# EAGLE schematic backplane-5 (EAGLE 8.3.1)

## Sheet 1 of 6
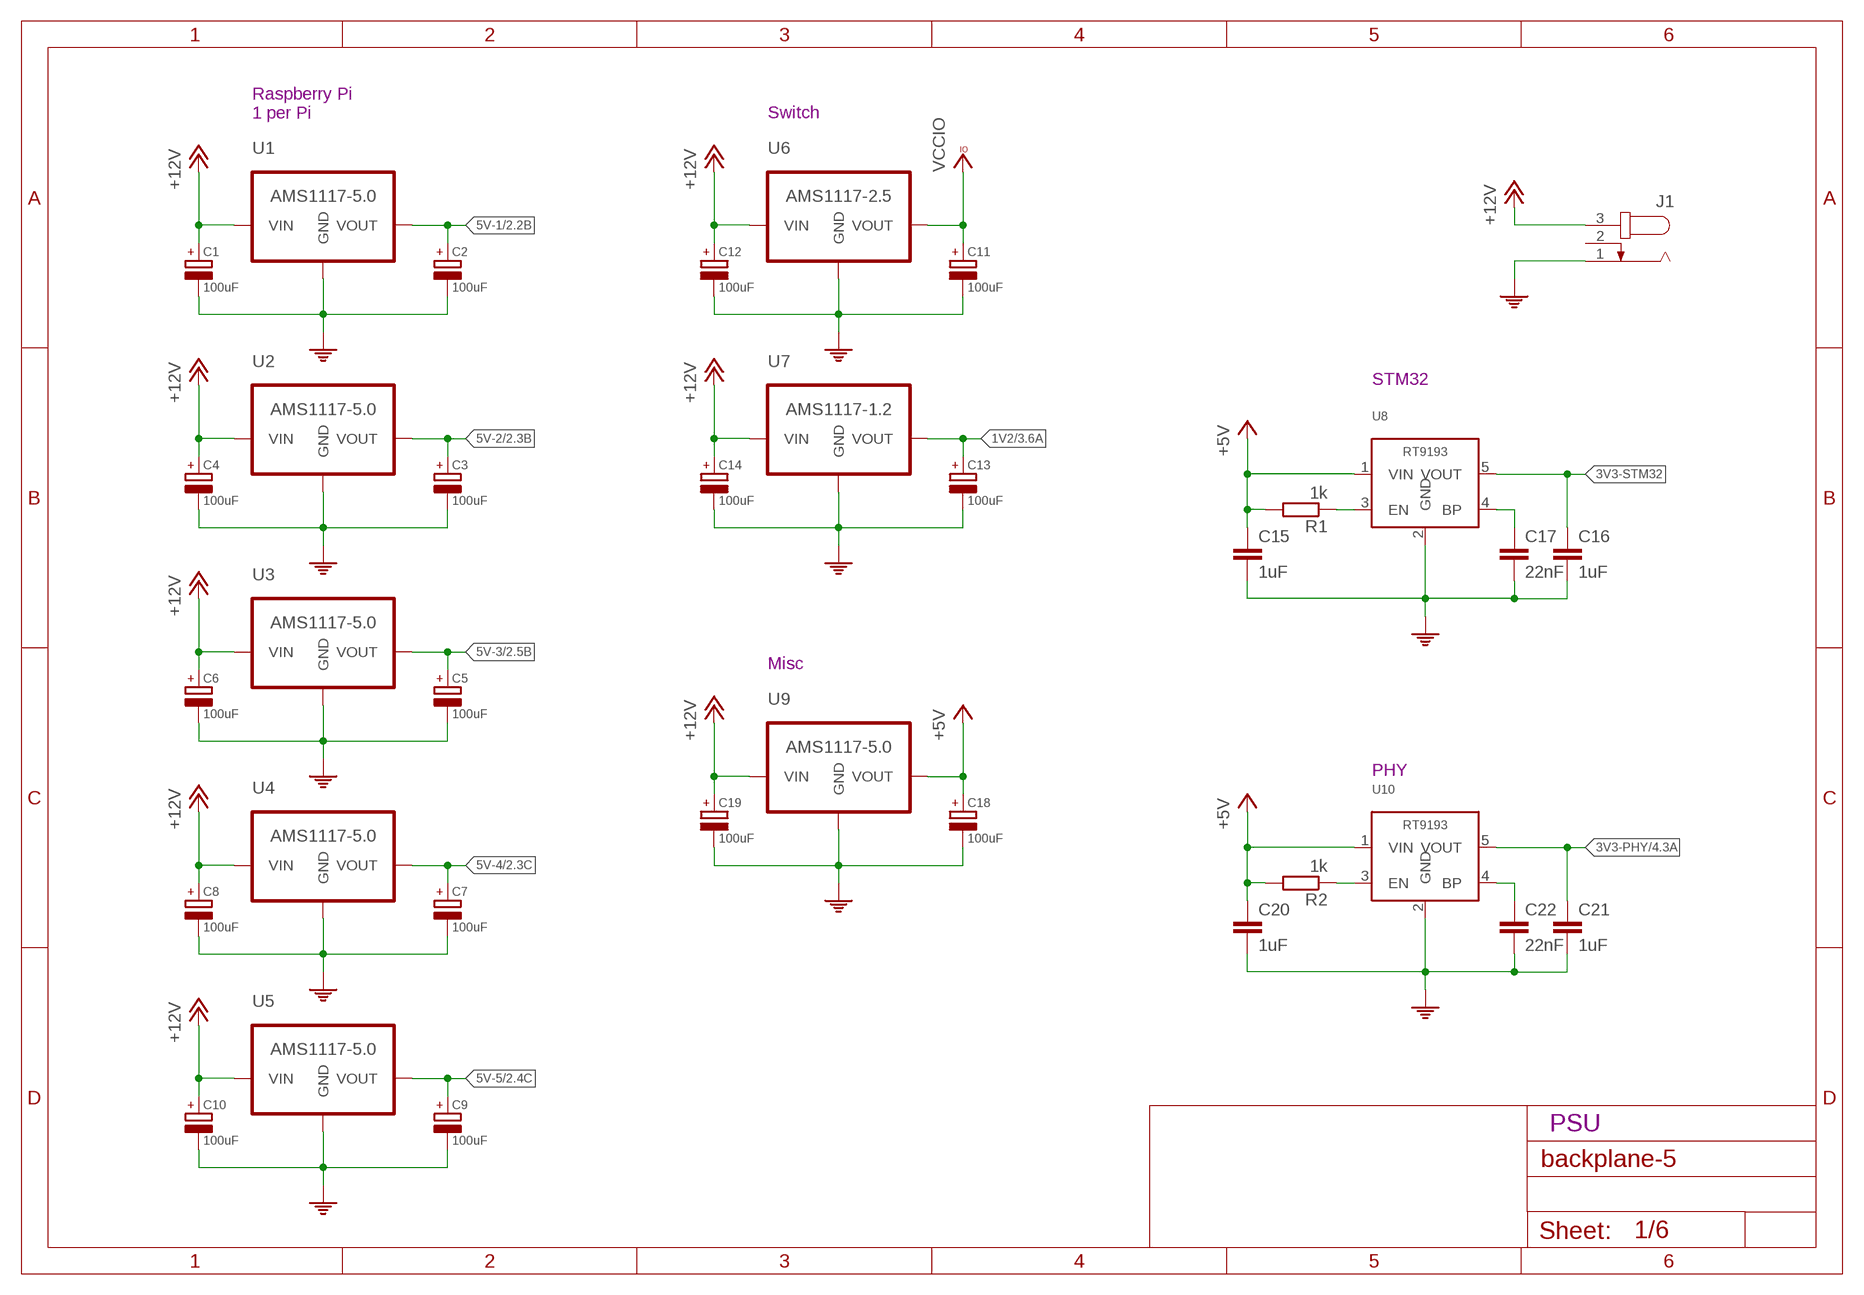
[diagram p0: schematic, sheet 1]

### Parts
C1  100uF  CAPACITOR  [CAP-D6.3]
C2  100uF  CAPACITOR  [CAP-D6.3]
C3  100uF  CAPACITOR  [CAP-D6.3]
C4  100uF  CAPACITOR  [CAP-D6.3]
C5  100uF  CAPACITOR  [CAP-D6.3]
C6  100uF  CAPACITOR  [CAP-D6.3]
C7  100uF  CAPACITOR  [CAP-D6.3]
C8  100uF  CAPACITOR  [CAP-D6.3]
C9  100uF  CAPACITOR  [CAP-D6.3]
C10  100uF  CAPACITOR  [CAP-D6.3]
C11  100uF  CAPACITOR  [CAP-D6.3]
C12  100uF  CAPACITOR  [CAP-D6.3]
C13  100uF  CAPACITOR  [CAP-D6.3]
C14  100uF  CAPACITOR  [CAP-D6.3]
C15  1uF  C-EUC0603  [C0603]
C16  1uF  C-EUC0603  [C0603]
C17  22nF  C-EUC0603  [C0603]
C18  100uF  CAPACITOR  [CAP-D6.3]
C19  100uF  CAPACITOR  [CAP-D6.3]
C20  1uF  C-EUC0603  [C0603]
C21  1uF  C-EUC0603  [C0603]
C22  22nF  C-EUC0603  [C0603]
J1  JACK-PLUG0  [SPC4077]
R1  1k  R-EU_R0603  [R0603]
R2  1k  R-EU_R0603  [R0603]
U1  AMS1117-5.0  LDOAMS1117  [SOT223]
U2  AMS1117-5.0  LDOAMS1117  [SOT223]
U3  AMS1117-5.0  LDOAMS1117  [SOT223]
U4  AMS1117-5.0  LDOAMS1117  [SOT223]
U5  AMS1117-5.0  LDOAMS1117  [SOT223]
U6  AMS1117-2.5  LDOAMS1117  [SOT223]
U7  AMS1117-1.2  LDOAMS1117  [SOT223]
U8  RT9193  [SOT23-5]
U9  AMS1117-5.0  LDOAMS1117  [SOT223]
U10  RT9193  [SOT23-5]

### Nets
1V2: C13.P(POS) U7.2(VOUT) ; also sheet 3,4
3V3-PHY: C21.1 U10.5(VOUT) ; also sheet 4,5
3V3-STM32: C16.1 U8.5(VOUT)
5V-1: C2.P(POS) U1.2(VOUT) ; also sheet 2
5V-2: C3.P(POS) U2.2(VOUT) ; also sheet 2
5V-3: C5.P(POS) U3.2(VOUT) ; also sheet 2
5V-4: C7.P(POS) U4.2(VOUT) ; also sheet 2
5V-5: C9.P(POS) U5.2(VOUT) ; also sheet 2
+5V: C15.1 C18.P(POS) C20.1 R1.2 R2.2 U8.1(VIN) U9.2(VOUT) U10.1(VIN)
+12V: C1.P(POS) C4.P(POS) C6.P(POS) C8.P(POS) C10.P(POS) C12.P(POS) C14.P(POS) C19.P(POS) J1.3 U1.3(VIN) U2.3(VIN) U3.3(VIN) U4.3(VIN) U5.3(VIN) U6.3(VIN) U7.3(VIN) U9.3(VIN)
GND: C1.N(NEG) C2.N(NEG) C3.N(NEG) C4.N(NEG) C5.N(NEG) C6.N(NEG) C7.N(NEG) C8.N(NEG) C9.N(NEG) C10.N(NEG) C11.N(NEG) C12.N(NEG) C13.N(NEG) C14.N(NEG) C15.2 C16.2 C17.2 C18.N(NEG) C19.N(NEG) C20.2 C21.2 C22.2 J1.1 U1.1(GND) U2.1(GND) U3.1(GND) U4.1(GND) U5.1(GND) U6.1(GND) U7.1(GND) U8.2(GND) U9.1(GND) U10.2(GND) ; supply symbol labelled gnd, PE ; also sheet 2,3,4,5,6
N$1: C17.1 U8.4(BP)
N$2: R1.1 U8.3(EN)
N$3: C22.1 U10.4(BP)
N$4: R2.1 U10.3(EN)
VCCIO: C11.P(POS) U6.2(VOUT) ; also sheet 3,4,5,6
Unconnected: J1.2

### Notes on the sheet
- Raspberry Pi
  1 per Pi
- Switch
- STM32
- Misc
- PHY
- PSU

## Sheet 2 of 6
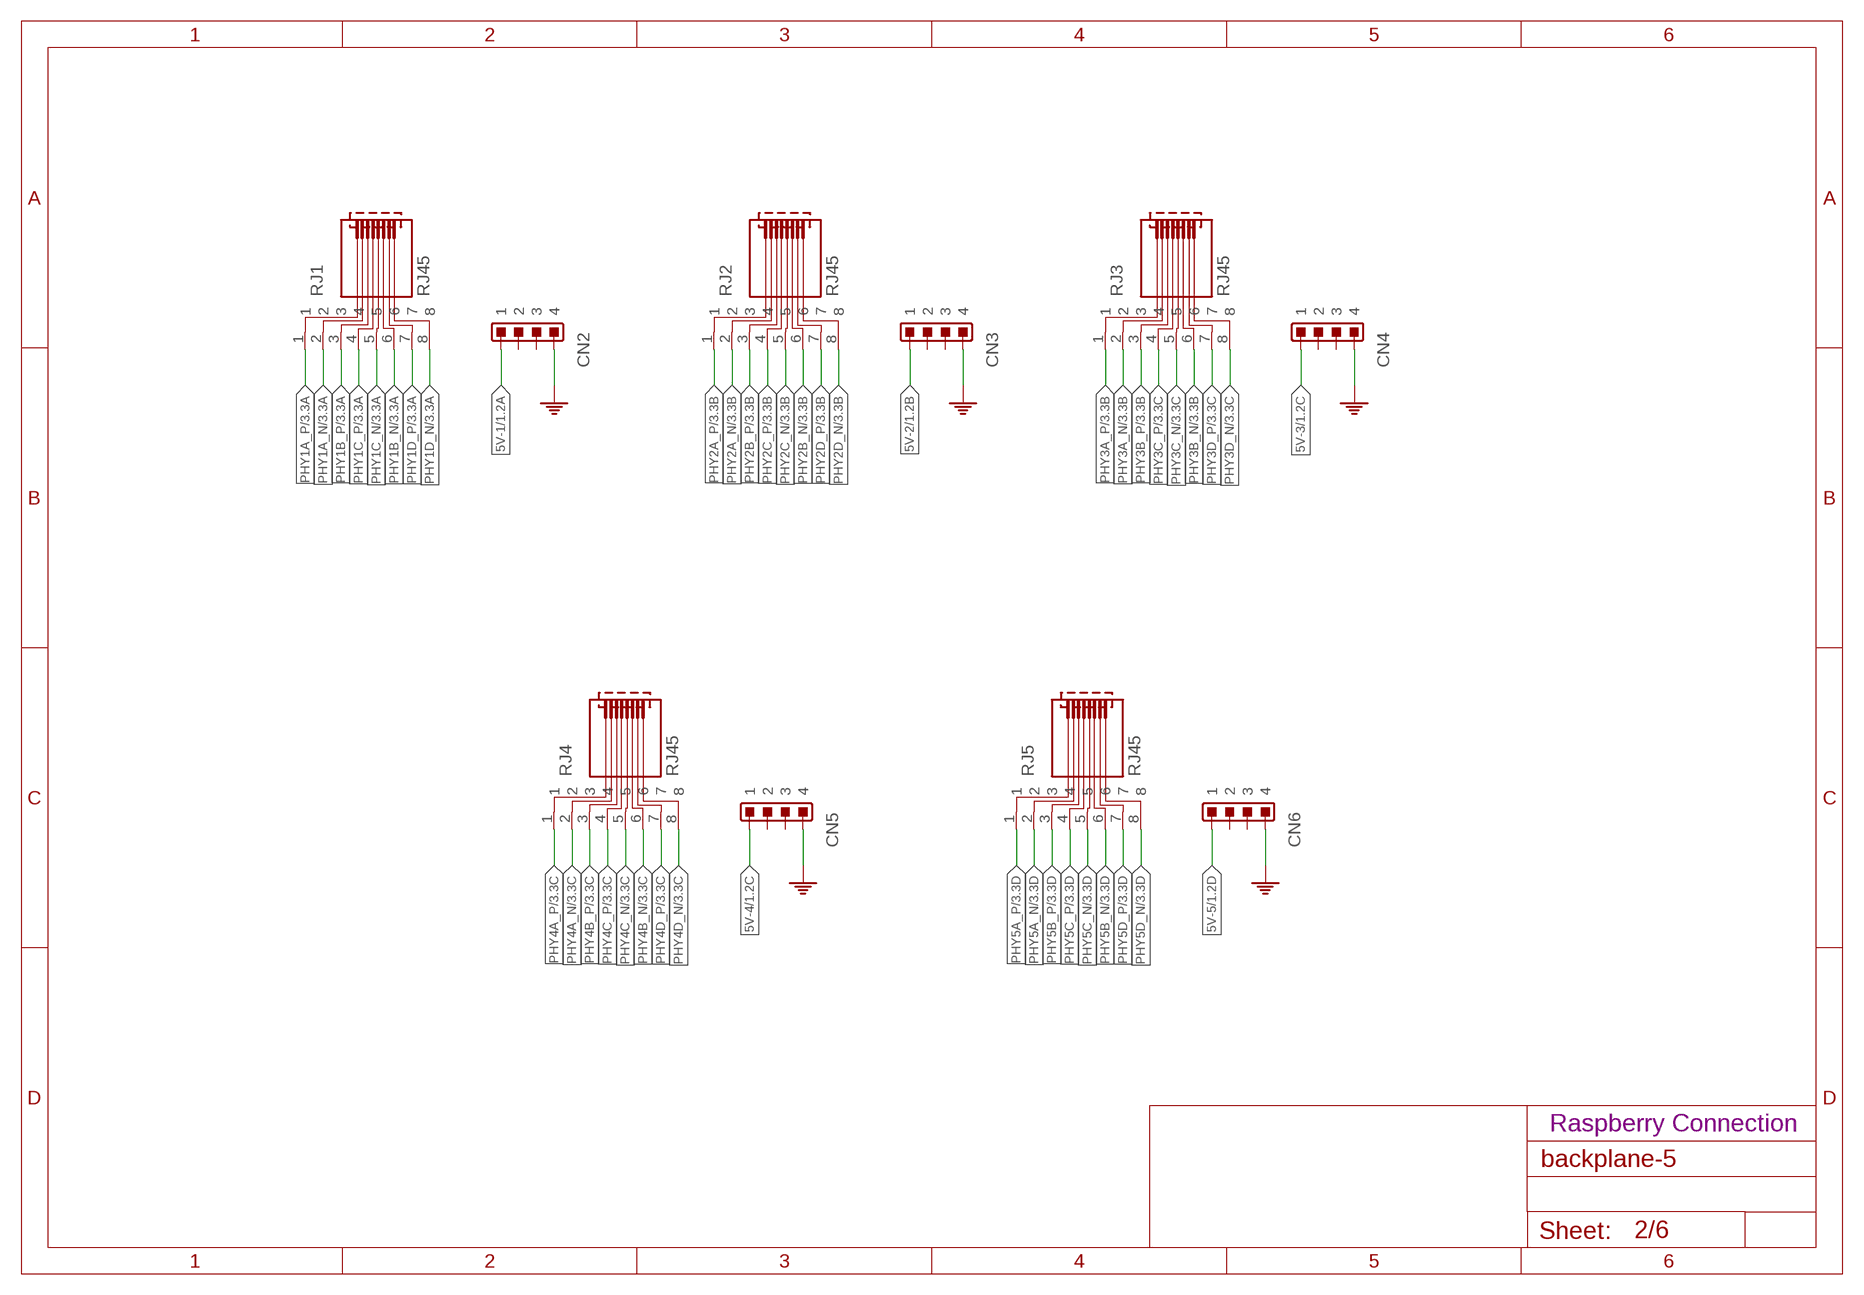
[diagram p1: schematic, sheet 2]

### Parts
CN2  4PINCONNFEMALE-1.6  [4PINCONN-FEMALE-1.6]
CN3  4PINCONNFEMALE-1.6  [4PINCONN-FEMALE-1.6]
CN4  4PINCONNFEMALE-1.6  [4PINCONN-FEMALE-1.6]
CN5  4PINCONNFEMALE-1.6  [4PINCONN-FEMALE-1.6]
CN6  4PINCONNFEMALE-1.6  [4PINCONN-FEMALE-1.6]
RJ1  RJ45PLUG  [RJ45MALE]
RJ2  RJ45PLUG  [RJ45MALE]
RJ3  RJ45PLUG  [RJ45MALE]
RJ4  RJ45PLUG  [RJ45MALE]
RJ5  RJ45PLUG  [RJ45MALE]

### Nets
5V-1: CN2.1@1 CN2.1@2 ; also sheet 1
5V-2: CN3.1@1 CN3.1@2 ; also sheet 1
5V-3: CN4.1@1 CN4.1@2 ; also sheet 1
5V-4: CN5.1@1 CN5.1@2 ; also sheet 1
5V-5: CN6.1@1 CN6.1@2 ; also sheet 1
GND: CN2.4@1 CN2.4@2 CN3.4@1 CN3.4@2 CN4.4@1 CN4.4@2 CN5.4@1 CN5.4@2 CN6.4@1 CN6.4@2 ; supply symbol labelled gnd ; also sheet 1,3,4,5,6
PHY1A_N: RJ1.2 ; also sheet 3
PHY1A_P: RJ1.1 ; also sheet 3
PHY1B_N: RJ1.6 ; also sheet 3
PHY1B_P: RJ1.3 ; also sheet 3
PHY1C_N: RJ1.5 ; also sheet 3
PHY1C_P: RJ1.4 ; also sheet 3
PHY1D_N: RJ1.8 ; also sheet 3
PHY1D_P: RJ1.7 ; also sheet 3
PHY2A_N: RJ2.2 ; also sheet 3
PHY2A_P: RJ2.1 ; also sheet 3
PHY2B_N: RJ2.6 ; also sheet 3
PHY2B_P: RJ2.3 ; also sheet 3
PHY2C_N: RJ2.5 ; also sheet 3
PHY2C_P: RJ2.4 ; also sheet 3
PHY2D_N: RJ2.8 ; also sheet 3
PHY2D_P: RJ2.7 ; also sheet 3
PHY3A_N: RJ3.2 ; also sheet 3
PHY3A_P: RJ3.1 ; also sheet 3
PHY3B_N: RJ3.6 ; also sheet 3
PHY3B_P: RJ3.3 ; also sheet 3
PHY3C_N: RJ3.5 ; also sheet 3
PHY3C_P: RJ3.4 ; also sheet 3
PHY3D_N: RJ3.8 ; also sheet 3
PHY3D_P: RJ3.7 ; also sheet 3
PHY4A_N: RJ4.2 ; also sheet 3
PHY4A_P: RJ4.1 ; also sheet 3
PHY4B_N: RJ4.6 ; also sheet 3
PHY4B_P: RJ4.3 ; also sheet 3
PHY4C_N: RJ4.5 ; also sheet 3
PHY4C_P: RJ4.4 ; also sheet 3
PHY4D_N: RJ4.8 ; also sheet 3
PHY4D_P: RJ4.7 ; also sheet 3
PHY5A_N: RJ5.2 ; also sheet 3
PHY5A_P: RJ5.1 ; also sheet 3
PHY5B_N: RJ5.6 ; also sheet 3
PHY5B_P: RJ5.3 ; also sheet 3
PHY5C_N: RJ5.5 ; also sheet 3
PHY5C_P: RJ5.4 ; also sheet 3
PHY5D_N: RJ5.8 ; also sheet 3
PHY5D_P: RJ5.7 ; also sheet 3
Unconnected: CN2.2@1 CN2.2@2 CN2.3@1 CN2.3@2 CN3.2@1 CN3.2@2 CN3.3@1 CN3.3@2 CN4.2@1 CN4.2@2 CN4.3@1 CN4.3@2 CN5.2@1 CN5.2@2 CN5.3@1 CN5.3@2 CN6.2@1 CN6.2@2 CN6.3@1 CN6.3@2

### Notes on the sheet
- Raspberry Connection

## Sheet 3 of 6
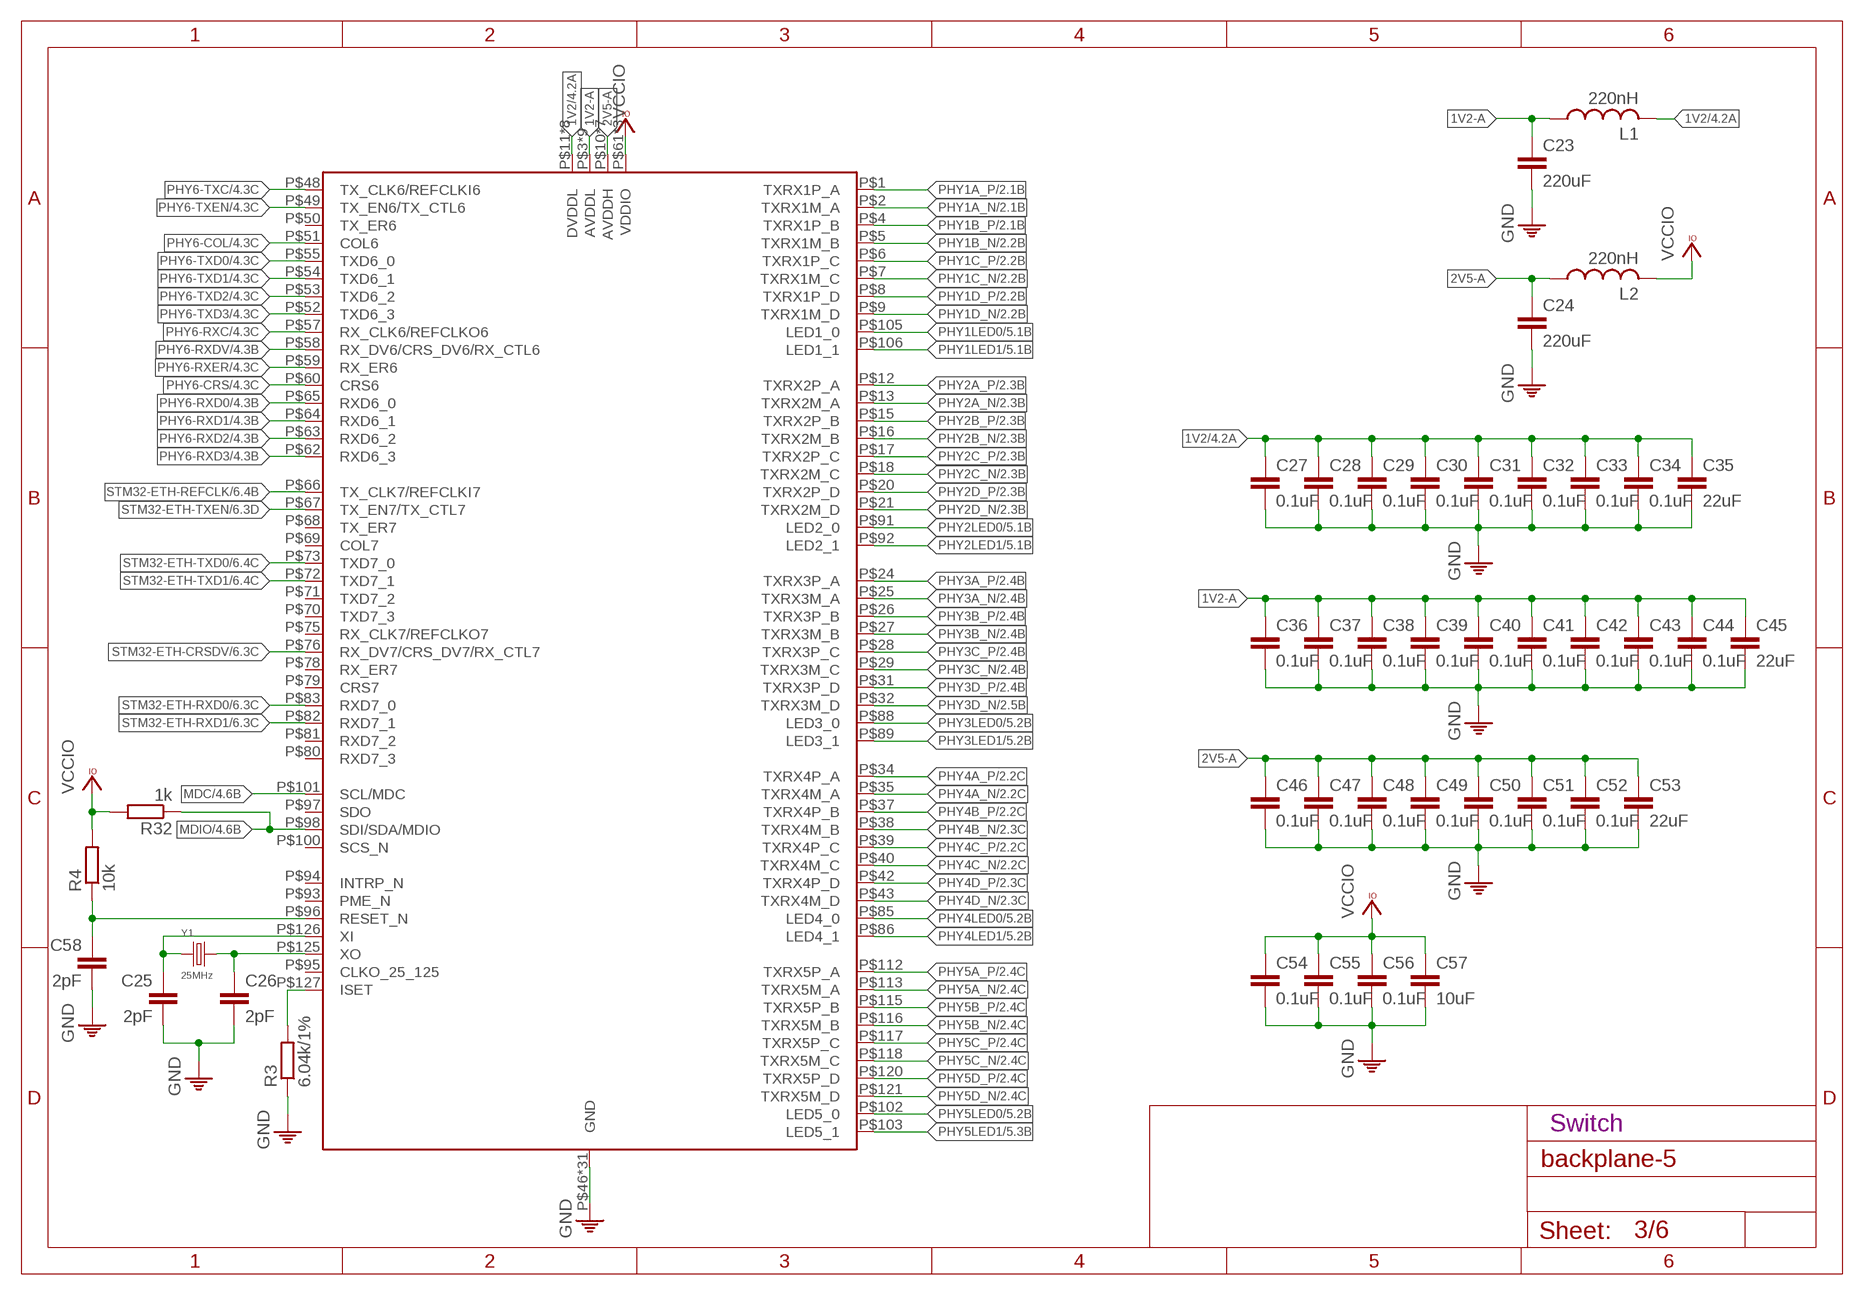
[diagram p2: schematic, sheet 3]

### Parts
C23  220uF  C0603  [0603]
C24  220uF  C0603  [0603]
C25  2pF  C0603  [0603]
C26  2pF  C0603  [0603]
C27  0.1uF  C0603  [0603]
C28  0.1uF  C0603  [0603]
C29  0.1uF  C0603  [0603]
C30  0.1uF  C0603  [0603]
C31  0.1uF  C0603  [0603]
C32  0.1uF  C0603  [0603]
C33  0.1uF  C0603  [0603]
C34  0.1uF  C0603  [0603]
C35  22uF  C0603  [0603]
C36  0.1uF  C0603  [0603]
C37  0.1uF  C0603  [0603]
C38  0.1uF  C0603  [0603]
C39  0.1uF  C0603  [0603]
C40  0.1uF  C0603  [0603]
C41  0.1uF  C0603  [0603]
C42  0.1uF  C0603  [0603]
C43  0.1uF  C0603  [0603]
C44  0.1uF  C0603  [0603]
C45  22uF  C0603  [0603]
C46  0.1uF  C0603  [0603]
C47  0.1uF  C0603  [0603]
C48  0.1uF  C0603  [0603]
C49  0.1uF  C0603  [0603]
C50  0.1uF  C0603  [0603]
C51  0.1uF  C0603  [0603]
C52  0.1uF  C0603  [0603]
C53  22uF  C0603  [0603]
C54  0.1uF  C0603  [0603]
C55  0.1uF  C0603  [0603]
C56  0.1uF  C0603  [0603]
C57  10uF  C0603  [0603]
C58  2pF  C0603  [0603]
L1  220nH  L1210  [1210]
L2  220nH  L1210  [1210]
R3  6.04k/1%  R-EU_R0603  [R0603]
R4  10k  R-EU_R0603  [R0603]
R32  1k  R-EU_R0603  [R0603]
U11  KSZ9897  [TQFP-128]
Y1  25MHz  CRYSTAL  [XTAL-2-SMD]

### Nets
1V2: C27.1 C28.1 C29.1 C30.1 C31.1 C32.1 C33.1 C34.1 C35.1 L1.2 U11.P$11(DVDDL) U11.P$23(DVDDL) U11.P$45(DVDDL) U11.P$56(DVDDL) U11.P$74(DVDDL) U11.P$87(DVDDL) U11.P$104(DVDDL) U11.P$110(DVDDL) ; also sheet 1,4
1V2-A: C23.1 C36.1 C37.1 C38.1 C39.1 C40.1 C41.1 C42.1 C43.1 C44.1 C45.1 L1.1 U11.P$3(AVDDL) U11.P$14(AVDDL) U11.P$19(AVDDL) U11.P$30(AVDDL) U11.P$36(AVDDL) U11.P$41(AVDDL) U11.P$114(AVDDL) U11.P$119(AVDDL) U11.P$124(AVDDL)
2V5-A: C24.1 C46.1 C47.1 C48.1 C49.1 C50.1 C51.1 C52.1 C53.1 L2.1 U11.P$10(AVDDH) U11.P$22(AVDDH) U11.P$33(AVDDH) U11.P$44(AVDDH) U11.P$111(AVDDH) U11.P$122(AVDDH) U11.P$128(AVDDH)
GND: C23.2 C24.2 C25.2 C26.2 C27.2 C28.2 C29.2 C30.2 C31.2 C32.2 C33.2 C34.2 C35.2 C36.2 C37.2 C38.2 C39.2 C40.2 C41.2 C42.2 C43.2 C44.2 C45.2 C46.2 C47.2 C48.2 C49.2 C50.2 C51.2 C52.2 C53.2 C54.2 C55.2 C56.2 C57.2 C58.2 R3.1 U11.P$46(GND) U11.P$47(GND) U11.P$84(GND) U11.P$107(GND) U11.P$109(GND) U11.P$123(GND) U11.P$129(GND) U11.P$130(GND) U11.P$131(GND) U11.P$132(GND) U11.P$133(GND) U11.P$134(GND) U11.P$135(GND) U11.P$136(GND) U11.P$137(GND) U11.P$138(GND) U11.P$139(GND) U11.P$140(GND) U11.P$141(GND) U11.P$142(GND) U11.P$143(GND) U11.P$144(GND) U11.P$145(GND) U11.P$146(GND) U11.P$147(GND) U11.P$148(GND) U11.P$149(GND) U11.P$150(GND) U11.P$151(GND) U11.P$152(GND) U11.P$153(GND) ; also sheet 1,2,4,5,6
MDC: U11.P$101(SCL/MDC) ; also sheet 4,6
MDIO: R32.1 U11.P$98(SDI/SDA/MDIO) ; also sheet 4,6
N$5: C25.1 U11.P$126(XI) Y1.P$2
N$6: C26.1 U11.P$125(XO) Y1.P$1
N$7: R3.2 U11.P$127(ISET)
N$8: C58.1 R4.1 U11.P$96(RESET_N)
PHY1A_N: U11.P$2(TXRX1M_A) ; also sheet 2
PHY1A_P: U11.P$1(TXRX1P_A) ; also sheet 2
PHY1B_N: U11.P$5(TXRX1M_B) ; also sheet 2
PHY1B_P: U11.P$4(TXRX1P_B) ; also sheet 2
PHY1C_N: U11.P$7(TXRX1M_C) ; also sheet 2
PHY1C_P: U11.P$6(TXRX1P_C) ; also sheet 2
PHY1D_N: U11.P$9(TXRX1M_D) ; also sheet 2
PHY1D_P: U11.P$8(TXRX1P_D) ; also sheet 2
PHY1LED0: U11.P$105(LED1_0) ; also sheet 5
PHY1LED1: U11.P$106(LED1_1) ; also sheet 5
PHY2A_N: U11.P$13(TXRX2M_A) ; also sheet 2
PHY2A_P: U11.P$12(TXRX2P_A) ; also sheet 2
PHY2B_N: U11.P$16(TXRX2M_B) ; also sheet 2
PHY2B_P: U11.P$15(TXRX2P_B) ; also sheet 2
PHY2C_N: U11.P$18(TXRX2M_C) ; also sheet 2
PHY2C_P: U11.P$17(TXRX2P_C) ; also sheet 2
PHY2D_N: U11.P$21(TXRX2M_D) ; also sheet 2
PHY2D_P: U11.P$20(TXRX2P_D) ; also sheet 2
PHY2LED0: U11.P$91(LED2_0) ; also sheet 5
PHY2LED1: U11.P$92(LED2_1) ; also sheet 5
PHY3A_N: U11.P$25(TXRX3M_A) ; also sheet 2
PHY3A_P: U11.P$24(TXRX3P_A) ; also sheet 2
PHY3B_N: U11.P$27(TXRX3M_B) ; also sheet 2
PHY3B_P: U11.P$26(TXRX3P_B) ; also sheet 2
PHY3C_N: U11.P$29(TXRX3M_C) ; also sheet 2
PHY3C_P: U11.P$28(TXRX3P_C) ; also sheet 2
PHY3D_N: U11.P$32(TXRX3M_D) ; also sheet 2
PHY3D_P: U11.P$31(TXRX3P_D) ; also sheet 2
PHY3LED0: U11.P$88(LED3_0) ; also sheet 5
PHY3LED1: U11.P$89(LED3_1) ; also sheet 5
PHY4A_N: U11.P$35(TXRX4M_A) ; also sheet 2
PHY4A_P: U11.P$34(TXRX4P_A) ; also sheet 2
PHY4B_N: U11.P$38(TXRX4M_B) ; also sheet 2
PHY4B_P: U11.P$37(TXRX4P_B) ; also sheet 2
PHY4C_N: U11.P$40(TXRX4M_C) ; also sheet 2
PHY4C_P: U11.P$39(TXRX4P_C) ; also sheet 2
PHY4D_N: U11.P$43(TXRX4M_D) ; also sheet 2
PHY4D_P: U11.P$42(TXRX4P_D) ; also sheet 2
PHY4LED0: U11.P$85(LED4_0) ; also sheet 5
PHY4LED1: U11.P$86(LED4_1) ; also sheet 5
PHY5A_N: U11.P$113(TXRX5M_A) ; also sheet 2
PHY5A_P: U11.P$112(TXRX5P_A) ; also sheet 2
PHY5B_N: U11.P$116(TXRX5M_B) ; also sheet 2
PHY5B_P: U11.P$115(TXRX5P_B) ; also sheet 2
PHY5C_N: U11.P$118(TXRX5M_C) ; also sheet 2
PHY5C_P: U11.P$117(TXRX5P_C) ; also sheet 2
PHY5D_N: U11.P$121(TXRX5M_D) ; also sheet 2
PHY5D_P: U11.P$120(TXRX5P_D) ; also sheet 2
PHY5LED0: U11.P$102(LED5_0) ; also sheet 5
PHY5LED1: U11.P$103(LED5_1) ; also sheet 5
PHY6-COL: U11.P$51(COL6) ; also sheet 4
PHY6-CRS: U11.P$60(CRS6) ; also sheet 4
PHY6-RXC: U11.P$57(RX_CLK6/REFCLKO6) ; also sheet 4
PHY6-RXD0: U11.P$65(RXD6_0) ; also sheet 4,5
PHY6-RXD1: U11.P$64(RXD6_1) ; also sheet 4,5
PHY6-RXD2: U11.P$63(RXD6_2) ; also sheet 4,5
PHY6-RXD3: U11.P$62(RXD6_3) ; also sheet 4,5
PHY6-RXDV: U11.P$58(RX_DV6/CRS_DV6/RX_CTL6) ; also sheet 4
PHY6-RXER: U11.P$59(RX_ER6) ; also sheet 4
PHY6-TXC: U11.P$48(TX_CLK6/REFCLKI6) ; also sheet 4
PHY6-TXD0: U11.P$55(TXD6_0) ; also sheet 4
PHY6-TXD1: U11.P$54(TXD6_1) ; also sheet 4
PHY6-TXD2: U11.P$53(TXD6_2) ; also sheet 4
PHY6-TXD3: U11.P$52(TXD6_3) ; also sheet 4
PHY6-TXEN: U11.P$49(TX_EN6/TX_CTL6) ; also sheet 4
STM32-ETH-CRSDV: U11.P$76(RX_DV7/CRS_DV7/RX_CTL7) ; also sheet 6
STM32-ETH-REFCLK: U11.P$66(TX_CLK7/REFCLKI7) ; also sheet 6
STM32-ETH-RXD0: U11.P$83(RXD7_0) ; also sheet 6
STM32-ETH-RXD1: U11.P$82(RXD7_1) ; also sheet 6
STM32-ETH-TXD0: U11.P$73(TXD7_0) ; also sheet 6
STM32-ETH-TXD1: U11.P$72(TXD7_1) ; also sheet 6
STM32-ETH-TXEN: U11.P$67(TX_EN7/TX_CTL7) ; also sheet 6
VCCIO: C54.1 C55.1 C56.1 C57.1 L2.2 R4.2 R32.2 U11.P$61(VDDIO) U11.P$77(VDDIO) U11.P$99(VDDIO) ; also sheet 1,4,5,6
Unconnected: U11.P$50(TX_ER6) U11.P$68(TX_ER7) U11.P$69(COL7) U11.P$70(TXD7_3) U11.P$71(TXD7_2) U11.P$75(RX_CLK7/REFCLKO7) U11.P$78(RX_ER7) U11.P$79(CRS7) U11.P$80(RXD7_3) U11.P$81(RXD7_2) U11.P$93(PME_N) U11.P$94(INTRP_N) U11.P$95(CLKO_25_125) U11.P$97(SDO) U11.P$100(SCS_N)

### Notes on the sheet
- Switch

## Sheet 4 of 6
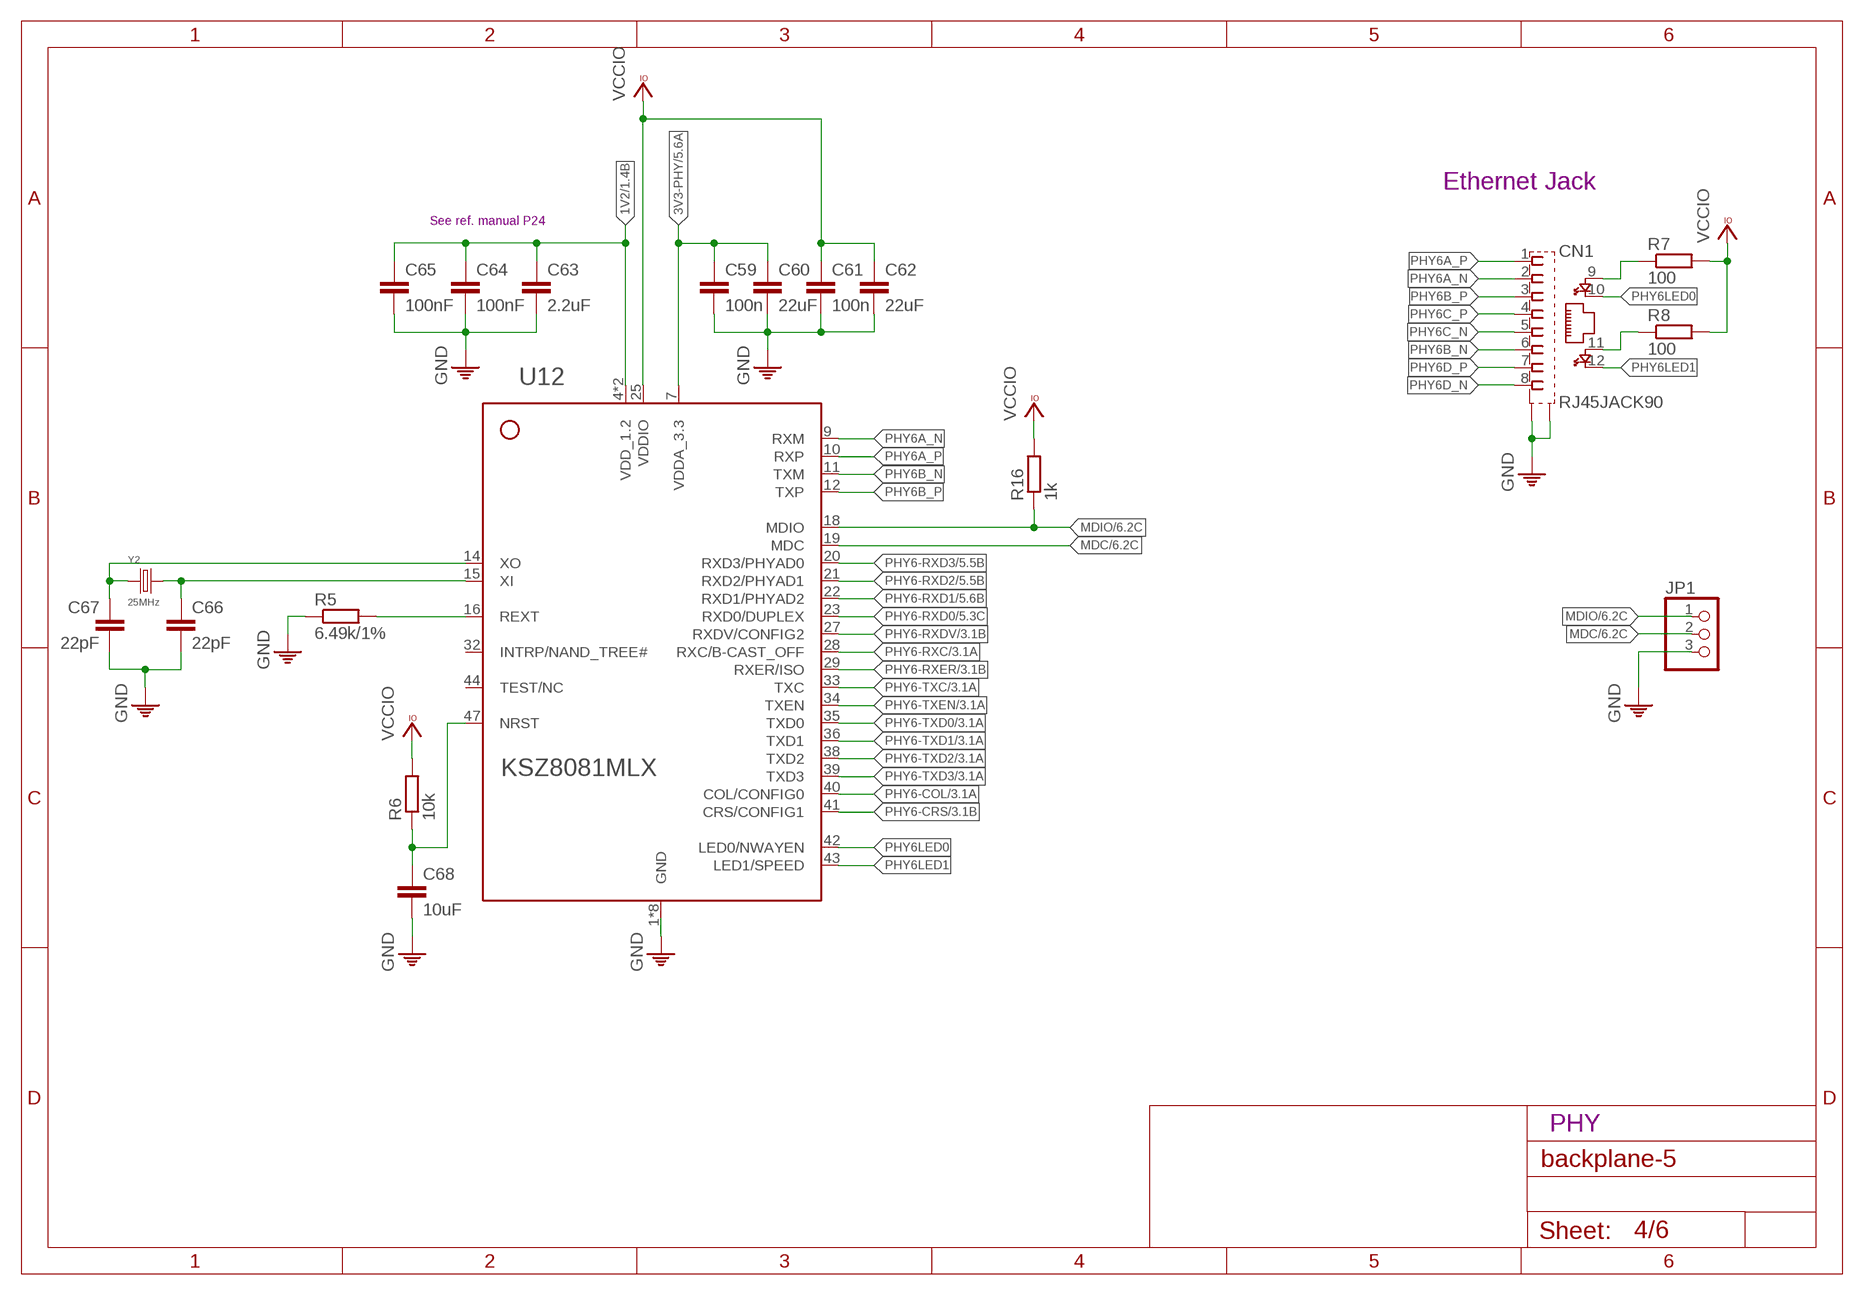
[diagram p3: schematic, sheet 4]

### Parts
C59  100n  C0603  [0603]
C60  22uF  C0603  [0603]
C61  100n  C0603  [0603]
C62  22uF  C0603  [0603]
C63  2.2uF  C0603  [0603]
C64  100nF  C0603  [0603]
C65  100nF  C0603  [0603]
C66  22pF  C0603  [0603]
C67  22pF  C0603  [0603]
C68  10uF  C0603  [0603]
CN1  RJ45JACK90  [RJ45JACK90]
JP1  PINHD-1X3  [1X03]
R5  6.49k/1%  R-EU_R0603  [R0603]
R6  10k  R-EU_R0603  [R0603]
R7  100  R-EU_R0603  [R0603]
R8  100  R-EU_R0603  [R0603]
R16  1k  R-EU_R0603  [R0603]
U12  KSZ8081MLX  [LQFP-48]
Y2  25MHz  CRYSTAL  [XTAL-2-SMD]

### Nets
1V2: C63.1 C64.1 C65.1 U12.4(VDD_1.2) U12.31(VDD_1.2) ; also sheet 1,3
3V3-PHY: C59.1 C60.1 U12.7(VDDA_3.3) ; also sheet 1,5
GND: C59.2 C60.2 C61.2 C62.2 C63.2 C64.2 C65.2 C66.2 C67.2 C68.2 CN1.S@1(S1) CN1.S@2(S2) JP1.3 R5.1 U12.1(GND) U12.2(GND) U12.3(GND) U12.13(GND) U12.17(GND) U12.24(GND) U12.30(GND) U12.37(GND) ; also sheet 1,2,3,5,6
MDC: JP1.2 U12.19(MDC) ; also sheet 3,6
MDIO: JP1.1 R16.1 U12.18(MDIO) ; also sheet 3,6
N$9: C66.1 U12.15(XI) Y2.P$1
N$10: C67.1 U12.14(XO) Y2.P$2
N$11: R5.2 U12.16(REXT)
N$12: C68.1 R6.1 U12.47(NRST)
N$13: CN1.9(YELLOW_A) R7.1
N$14: CN1.11(GREEN_A) R8.1
PHY6-COL: U12.40(COL/CONFIG0) ; also sheet 3
PHY6-CRS: U12.41(CRS/CONFIG1) ; also sheet 3
PHY6-RXC: U12.28(RXC/B-CAST_OFF) ; also sheet 3
PHY6-RXD0: U12.23(RXD0/DUPLEX) ; also sheet 3,5
PHY6-RXD1: U12.22(RXD1/PHYAD2) ; also sheet 3,5
PHY6-RXD2: U12.21(RXD2/PHYAD1) ; also sheet 3,5
PHY6-RXD3: U12.20(RXD3/PHYAD0) ; also sheet 3,5
PHY6-RXDV: U12.27(RXDV/CONFIG2) ; also sheet 3
PHY6-RXER: U12.29(RXER/ISO) ; also sheet 3
PHY6-TXC: U12.33(TXC) ; also sheet 3
PHY6-TXD0: U12.35(TXD0) ; also sheet 3
PHY6-TXD1: U12.36(TXD1) ; also sheet 3
PHY6-TXD2: U12.38(TXD2) ; also sheet 3
PHY6-TXD3: U12.39(TXD3) ; also sheet 3
PHY6-TXEN: U12.34(TXEN) ; also sheet 3
PHY6A_N: CN1.2 U12.9(RXM)
PHY6A_P: CN1.1 U12.10(RXP)
PHY6B_N: CN1.6 U12.11(TXM)
PHY6B_P: CN1.3 U12.12(TXP)
PHY6C_N: CN1.5
PHY6C_P: CN1.4
PHY6D_N: CN1.8
PHY6D_P: CN1.7
PHY6LED0: CN1.10(YELLOW_C) U12.42(LED0/NWAYEN)
PHY6LED1: CN1.12(GREEN_C) U12.43(LED1/SPEED)
VCCIO: C61.1 C62.1 R6.2 R7.2 R8.2 R16.2 U12.25(VDDIO) ; also sheet 1,3,5,6
Unconnected: U12.32(INTRP/NAND_TREE#) U12.44(TEST/NC)

### Notes on the sheet
- Ethernet Jack
- See ref. manual P24
- PHY

## Sheet 5 of 6
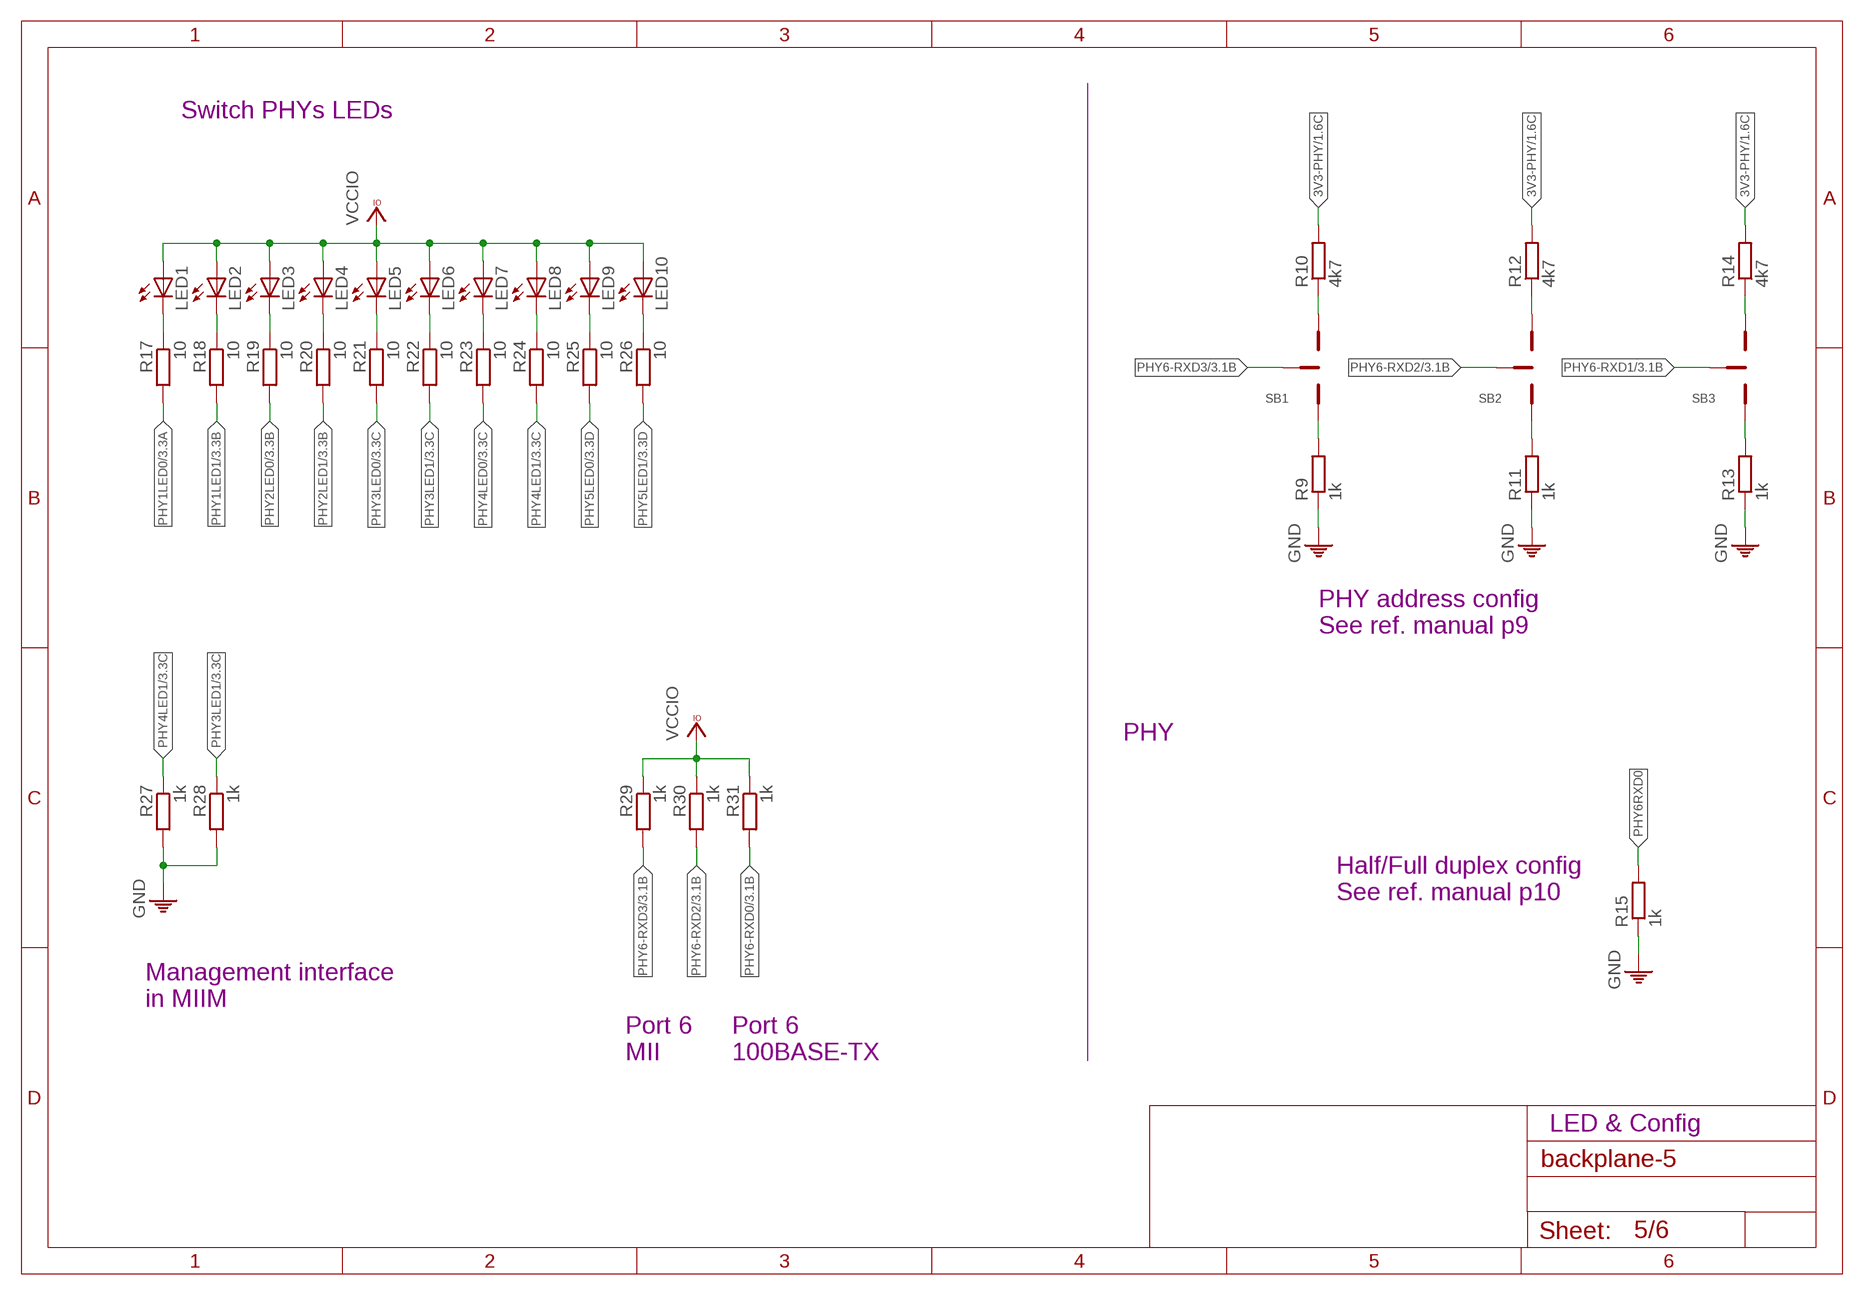
[diagram p4: schematic, sheet 5]

### Parts
LED1  LEDCHIPLED_0603  [CHIPLED_0603]
LED2  LEDCHIPLED_0603  [CHIPLED_0603]
LED3  LEDCHIPLED_0603  [CHIPLED_0603]
LED4  LEDCHIPLED_0603  [CHIPLED_0603]
LED5  LEDCHIPLED_0603  [CHIPLED_0603]
LED6  LEDCHIPLED_0603  [CHIPLED_0603]
LED7  LEDCHIPLED_0603  [CHIPLED_0603]
LED8  LEDCHIPLED_0603  [CHIPLED_0603]
LED9  LEDCHIPLED_0603  [CHIPLED_0603]
LED10  LEDCHIPLED_0603  [CHIPLED_0603]
R9  1k  R-EU_R0603  [R0603]
R10  4k7  R-EU_R0603  [R0603]
R11  1k  R-EU_R0603  [R0603]
R12  4k7  R-EU_R0603  [R0603]
R13  1k  R-EU_R0603  [R0603]
R14  4k7  R-EU_R0603  [R0603]
R15  1k  R-EU_R0603  [R0603]
R17  10  R-EU_R0603  [R0603]
R18  10  R-EU_R0603  [R0603]
R19  10  R-EU_R0603  [R0603]
R20  10  R-EU_R0603  [R0603]
R21  10  R-EU_R0603  [R0603]
R22  10  R-EU_R0603  [R0603]
R23  10  R-EU_R0603  [R0603]
R24  10  R-EU_R0603  [R0603]
R25  10  R-EU_R0603  [R0603]
R26  10  R-EU_R0603  [R0603]
R27  1k  R-EU_R0603  [R0603]
R28  1k  R-EU_R0603  [R0603]
R29  1k  R-EU_R0603  [R0603]
R30  1k  R-EU_R0603  [R0603]
R31  1k  R-EU_R0603  [R0603]
SB1  SB  [SB]
SB2  SB  [SB]
SB3  SB  [SB]

### Nets
3V3-PHY: R10.2 R12.2 R14.2 ; also sheet 1,4
GND: R9.1 R11.1 R13.1 R15.1 R27.2 R28.2 ; also sheet 1,2,3,4,6
N$15: R11.2 SB2.1
N$16: R9.2 SB1.1
N$17: R10.1 SB1.3
N$18: R12.1 SB2.3
N$19: R13.2 SB3.1
N$20: R14.1 SB3.3
N$24: LED1.C R17.1
N$25: LED2.C R18.1
N$26: LED3.C R19.1
N$27: LED4.C R20.1
N$28: LED5.C R21.1
N$29: LED6.C R22.1
N$30: LED7.C R23.1
N$31: LED8.C R24.1
N$32: LED9.C R25.1
N$33: LED10.C R26.1
PHY1LED0: R17.2 ; also sheet 3
PHY1LED1: R18.2 ; also sheet 3
PHY2LED0: R19.2 ; also sheet 3
PHY2LED1: R20.2 ; also sheet 3
PHY3LED0: R21.2 ; also sheet 3
PHY3LED1: R22.2 R28.1 ; also sheet 3
PHY4LED0: R23.2 ; also sheet 3
PHY4LED1: R24.2 R27.1 ; also sheet 3
PHY5LED0: R25.2 ; also sheet 3
PHY5LED1: R26.2 ; also sheet 3
PHY6-RXD0: R31.2 ; also sheet 3,4
PHY6-RXD1: SB3.2 ; also sheet 3,4
PHY6-RXD2: R30.2 SB2.2 ; also sheet 3,4
PHY6-RXD3: R29.2 SB1.2 ; also sheet 3,4
PHY6RXD0: R15.2
VCCIO: LED1.A LED2.A LED3.A LED4.A LED5.A LED6.A LED7.A LED8.A LED9.A LED10.A R29.1 R30.1 R31.1 ; also sheet 1,3,4,6

### Notes on the sheet
- Switch PHYs LEDs
- PHY address config
  See ref. manual p9
- PHY
- Half/Full duplex config
  See ref. manual p10
- Management interface
  in MIIM
- Port 6
  MII
- Port 6
  100BASE-TX
- LED & Config

## Sheet 6 of 6
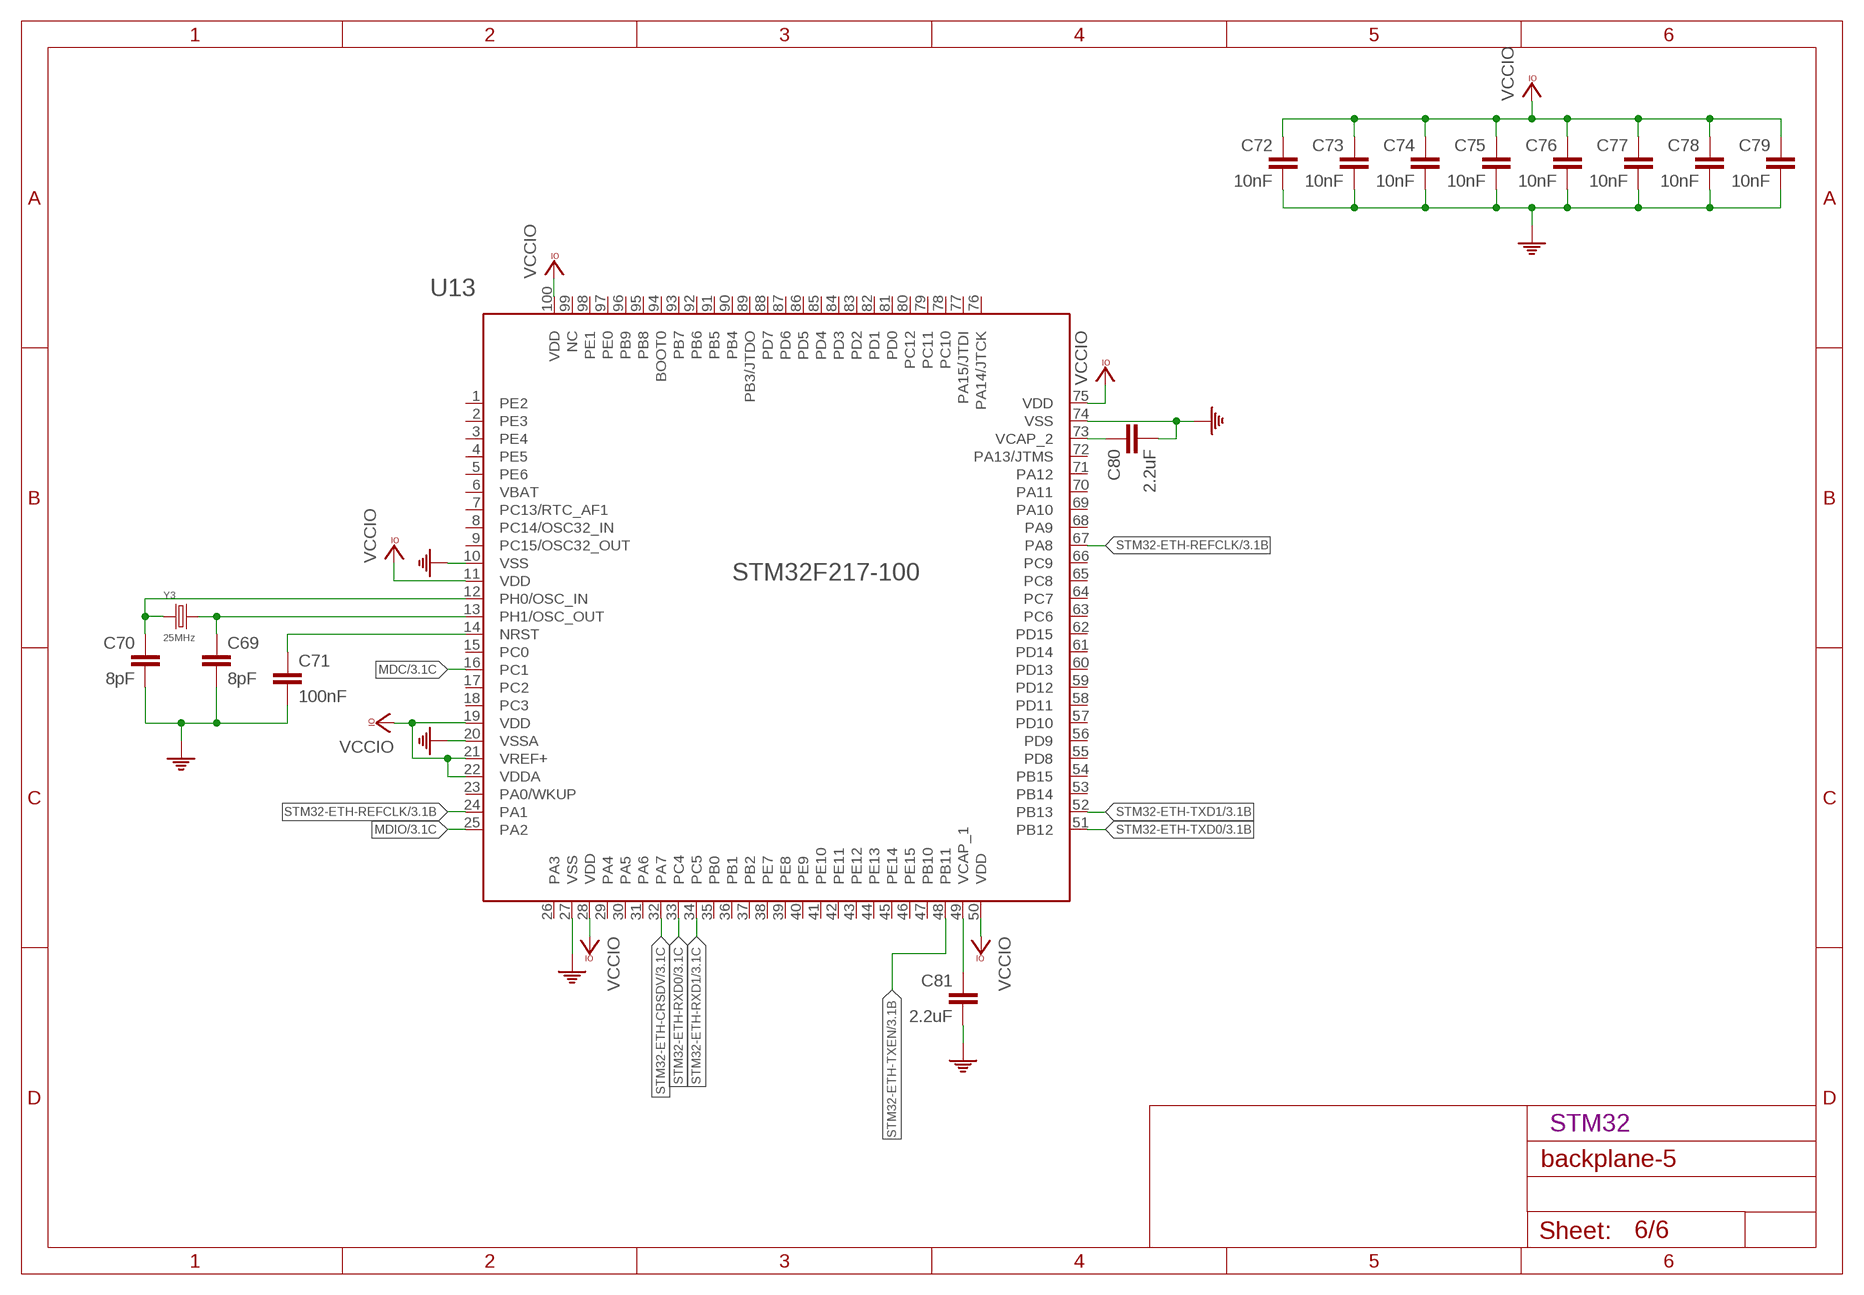
[diagram p5: schematic, sheet 6]

### Parts
C69  8pF  C0603  [0603]
C70  8pF  C0603  [0603]
C71  100nF  C0603  [0603]
C72  10nF  C0603  [0603]
C73  10nF  C0603  [0603]
C74  10nF  C0603  [0603]
C75  10nF  C0603  [0603]
C76  10nF  C0603  [0603]
C77  10nF  C0603  [0603]
C78  10nF  C0603  [0603]
C79  10nF  C0603  [0603]
C80  2.2uF  C0805  [0805]
C81  2.2uF  C0805  [0805]
U13  STM32F217-100  [LQFP-100]
Y3  25MHz  CRYSTAL  [XTAL-2-SMD]

### Nets
GND: C69.2 C70.2 C71.2 C72.2 C73.2 C74.2 C75.2 C76.2 C77.2 C78.2 C79.2 C80.2 C81.2 U13.10(VSS) U13.20(VSSA) U13.27(VSS) U13.74(VSS) ; supply symbol labelled PE ; also sheet 1,2,3,4,5
MDC: U13.16(PC1) ; also sheet 3,4
MDIO: U13.25(PA2) ; also sheet 3,4
N$21: C69.1 U13.13(PH1/OSC_OUT) Y3.P$1
N$22: C70.1 U13.12(PH0/OSC_IN) Y3.P$2
N$23: C71.1 U13.14(NRST)
N$34: C80.1 U13.73(VCAP_2)
N$35: C81.1 U13.49(VCAP_1)
STM32-ETH-CRSDV: U13.32(PA7) ; also sheet 3
STM32-ETH-REFCLK: U13.24(PA1) U13.67(PA8) ; also sheet 3
STM32-ETH-RXD0: U13.33(PC4) ; also sheet 3
STM32-ETH-RXD1: U13.34(PC5) ; also sheet 3
STM32-ETH-TXD0: U13.51(PB12) ; also sheet 3
STM32-ETH-TXD1: U13.52(PB13) ; also sheet 3
STM32-ETH-TXEN: U13.48(PB11) ; also sheet 3
VCCIO: C72.1 C73.1 C74.1 C75.1 C76.1 C77.1 C78.1 C79.1 U13.11(VDD) U13.19(VDD) U13.21(VREF+) U13.22(VDDA) U13.28(VDD) U13.50(VDD) U13.75(VDD) U13.100(VDD) ; also sheet 1,3,4,5
Unconnected: U13.1(PE2) U13.2(PE3) U13.3(PE4) U13.4(PE5) U13.5(PE6) U13.6(VBAT) U13.7(PC13/RTC_AF1) U13.8(PC14/OSC32_IN) U13.9(PC15/OSC32_OUT) U13.15(PC0) U13.17(PC2) U13.18(PC3) U13.23(PA0/WKUP) U13.26(PA3) U13.29(PA4) U13.30(PA5) U13.31(PA6) U13.35(PB0) U13.36(PB1) U13.37(PB2) U13.38(PE7) U13.39(PE8) U13.40(PE9) U13.41(PE10) U13.42(PE11) U13.43(PE12) U13.44(PE13) U13.45(PE14) U13.46(PE15) U13.47(PB10) U13.53(PB14) U13.54(PB15) U13.55(PD8) U13.56(PD9) U13.57(PD10) U13.58(PD11) U13.59(PD12) U13.60(PD13) U13.61(PD14) U13.62(PD15) U13.63(PC6) U13.64(PC7) U13.65(PC8) U13.66(PC9) U13.68(PA9) U13.69(PA10) U13.70(PA11) U13.71(PA12) U13.72(PA13/JTMS) U13.76(PA14/JTCK) U13.77(PA15/JTDI) U13.78(PC10) U13.79(PC11) U13.80(PC12) U13.81(PD0) U13.82(PD1) U13.83(PD2) U13.84(PD3) U13.85(PD4) U13.86(PD5) U13.87(PD6) U13.88(PD7) U13.89(PB3/JTDO) U13.90(PB4) U13.91(PB5) U13.92(PB6) U13.93(PB7) U13.94(BOOT0) U13.95(PB8) U13.96(PB9) U13.97(PE0) U13.98(PE1) U13.99(NC)

### Notes on the sheet
- STM32

## Library data of the parts
C1-C14 C18 C19 = tuetuopay:CAPACITOR
C15-C17 C20-C22 = rcl:C-EU: CAPACITOR, European symbol
C23-C81 = tuetuopay:C
CN1 = tuetuopay:RJ45JACK90: RJ-45 INVERTED MODULAR JACK ASSEMBLY WITH RJ-11 KEEPOUT FEATURE Source: Data sheet <http://www.farnell.com/datasheets/73207.pdf> MOLEX 0446200002 BUCHSE, RJ45, GESCHIRMT Source: Farnell <http://de.farnell.com/molex/0446200002/buchse-rj45-geschirmt/dp/9251910?ost=9251910>; MF: MOLEX; MPN: 0446200002; OC_FARNELL: 9251910
CN2-CN6 = tuetuopay:4PINCONN
J1 = tuetuopay:JACK-PLUG: DC POWER JACK Power Jack, DC, Right Angle, Through Hole, Rated 5A at 16VDC, PC Terminals Distributor: Farnell (www.Farnell.de) Drawing: 84N1161.pdf / 84N1162.pdf Manufacturer: SPC Technology (www.spctechnology.com) Type: SPC4077 / SPC 4078; OC_FARNELL: unknown; OC_NEWARK: unknown
JP1 = pinhead:PINHD-1X3: PIN HEADER
L1 L2 = tuetuopay:L
LED1-LED10 = led:LED: LED OSRAM: - CHIPLED LG R971, LG N971, LY N971, LG Q971, LY Q971, LO R971, LY R971 LH N974, LH R974 LS Q976, LO Q976, LY Q976 LO Q996 - Hyper CHIPLED LW Q18S LB Q993, LB Q99A, LB R99A - SideLED LS A670, LO A670, LY A670, LG A670, LP A670 LB A673, LV A673, LT A673, LW A673 LH A674 LY A675 LS A676, LA A676, LO A676, LY A676, LW A676 LS A679, LY A679, LG A679 - Hyper Micro SIDELED® LS Y876, LA Y876, LO Y876, LY Y876 LT Y87S - SmartLED LW L88C, LW L88S LB L89C, LB L89S, LG L890 LS L89K, LO L89K, LY L89K LS L896, LA L896, LO L896, LY L896 - TOPLED LS T670, LO T670, LY T670, LG T670, LP T670 LSG T670, LSP T670, LSY T670, LOP T670, LYG T670 LG T671, LOG T671, LSG T671 LB T673, LV T673, LT T673, LW T673 LH T674 LS T676, LA T676, LO T676, LY T676, LB T676, LH T676, LSB T676, LW T676 LB T67C, LV T67C, LT T67C, LS T67K, LO T67K, LY T67K, LW E67C LS E67B, LA E67B, LO E67B, LY E67B, LB E67C, LV E67C, LT E67C LW T67C LS T679, LY T679, LG T679 LS T770, LO T770, LY T770, LG T770, LP T770 LB T773, LV T773, LT T773, LW T773 LH T774 LS E675, LA E675, LY E675, LS T675 LS T776, LA T776, LO T776, LY T776, LB T776 LHGB T686 LT T68C, LB T68C - Hyper Mini TOPLED® LB M676 - Mini TOPLED Santana® LG M470 LS M47K, LO M47K, LY M47K Source: http://www.osram.convergy.de LUXEON: - LUMILED® LXK2-PW12-R00, LXK2-PW12-S00, LXK2-PW14-U00, LXK2-PW14-V00 LXK2-PM12-R00, LXK2-PM12-S00, LXK2-PM14-U00 LXK2-PE12-Q00, LXK2-PE12-R00, LXK2-PE12-S00, LXK2-PE14-T00, LXK2-PE14-U00 LXK2-PB12-K00, LXK2-PB12-L00, LXK2-PB12-M00, LXK2-PB14-N00, LXK2-PB14-P00, LXK2-PB14-Q00 LXK2-PR12-L00, LXK2-PR12-M00, LXK2-PR14-Q00, LXK2-PR14-R00 LXK2-PD12-Q00, LXK2-PD12-R00, LXK2-PD12-S00 LXK2-PH12-R00, LXK2-PH12-S00 LXK2-PL12-P00, LXK2-PL12-Q00, LXK2-PL12-R00 Source: www.luxeon.com KINGBRIGHT: KA-3528ASYC Source: www.kingbright.com
R1-R32 = rcl:R-EU_: RESISTOR, European symbol
RJ1-RJ5 = tuetuopay:RJ45PLUG
SB1-SB3 = tuetuopay:SB
U1-U7 U9 = tuetuopay:LDO
U8 U10 = tuetuopay:RT9193
U11 = tuetuopay:KSZ9897
U12 = tuetuopay:KSZ8081MLX
U13 = tuetuopay:STM32F217-100
Y1-Y3 = tuetuopay:CRYSTAL